# Altium schematic sheet CEM3340.SchDoc
size B; SheetNumber: 1; SheetTotal: 1
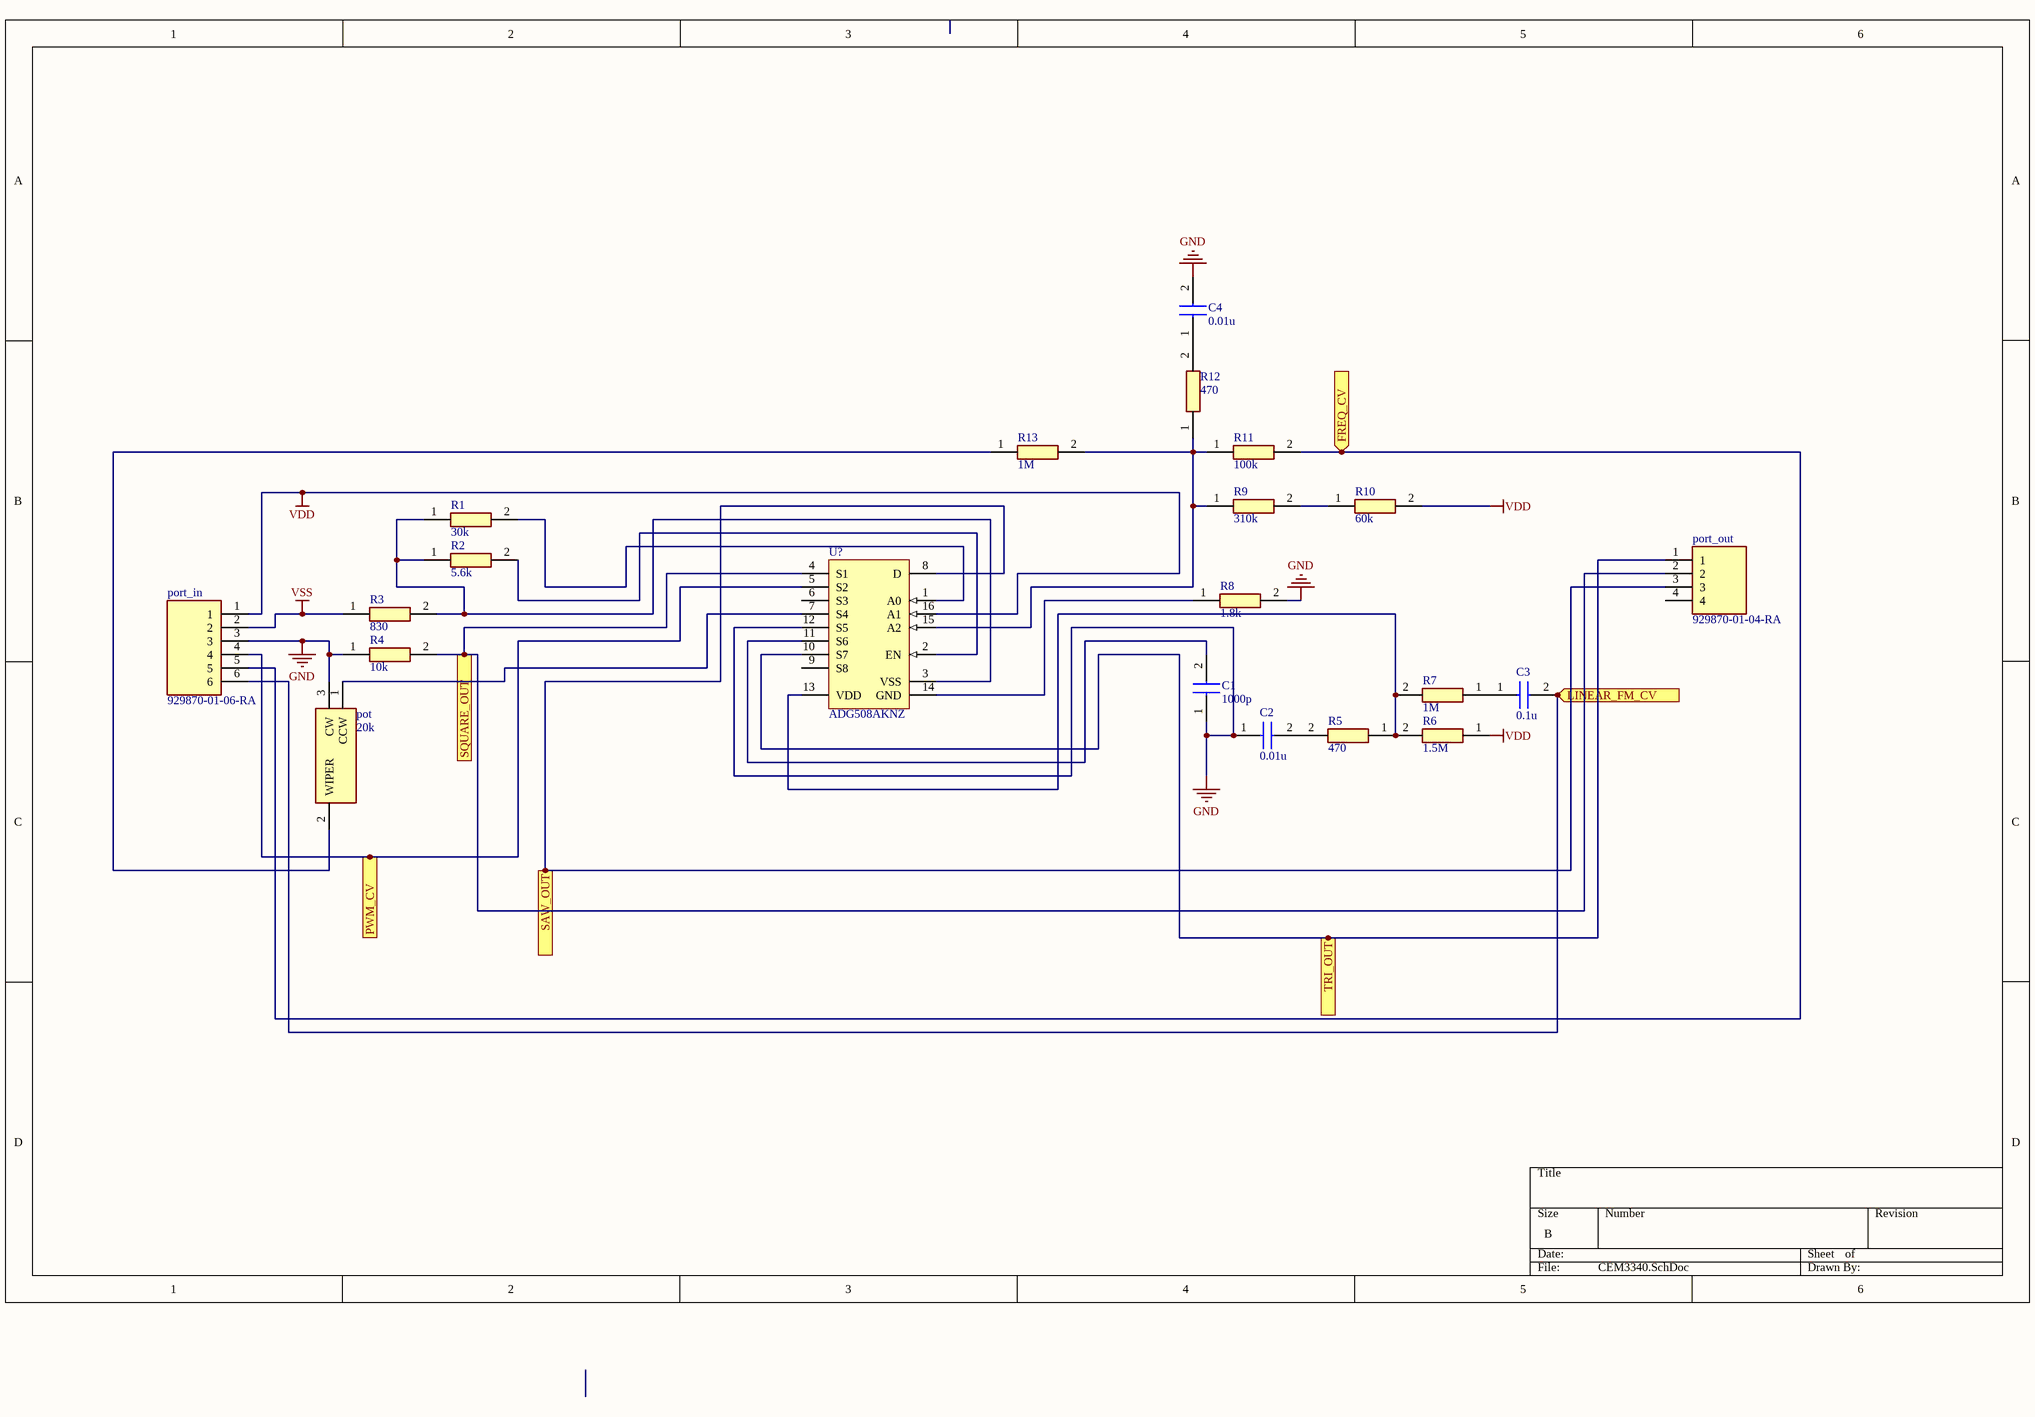
[diagram p0: CEM3340.SchDoc]

## Parts
C1  1000p  [CAPPA2400W30L800D400]
C2  0.01u  [CAPPA2400W30L800D400]
C3  0.1u  [CAPPA2400W30L800D400]
C4  0.01u  [CAPPA2400W30L800D400]
port_in  929870-01-06-RA  [RHDR6W64P0X254_1X6_1524X254X380P]
port_out  929870-01-04-RA  [RHDR4W76P0X254_1X4_1016X254X826P]
pot  20k  [3296P1502LF]
R1  30k  [RESAD1650W60L650D250]
R2  5.6k  [RESAD1650W60L650D250]
R3  830  [RESAD1650W60L650D250]
R4  10k  [RESAD1650W60L650D250]
R5  470  [RESAD1650W60L650D250]
R6  1.5M  [RESAD1650W60L650D250]
R7  1M  [RESAD1650W60L650D250]
R8  1.8k  [RESAD1650W60L650D250]
R9  310k  [RESAD1650W60L650D250]
R10  60k  [RESAD1650W60L650D250]
R11  100k  [RESAD1650W60L650D250]
R12  470  [RESAD1650W60L650D250]
R13  1M  [RESAD1650W60L650D250]
U?  ADG508AKNZ  [ADI-N-16]

## Ports
FREQ_CV (in), LINEAR_FM_CV (in), PWM_CV, SAW_OUT, SQUARE_OUT, TRI_OUT

## Nets
GND: C1.1(+) C2.1(+) C4.2(-) port_in.3 pot.3(CW) R4.1 R8.2 U?.12(S5)
VDD: port_in.1 R6.1 R10.2 U?.16(A1)
VSS: port_in.2 R3.1
FREQ_CV: port_in.5 R11.2 ; port FREQ_CV
LINEAR_FM_CV: C3.2(-) port_in.6 ; port LINEAR_FM_CV
PWM_CV: port_in.4 U?.5(S2) ; port PWM_CV
SAW_OUT: port_out.3 U?.8(D) ; port SAW_OUT
SQUARE_OUT: port_out.2 R4.2 U?.4(S1) ; port SQUARE_OUT
TRI_OUT: port_out.1 U?.10(S7) ; port TRI_OUT
NetC1_2: C1.2(-) U?.11(S6)
NetC2_2: C2.2(-) R5.2
NetC3_1: C3.1(+) R7.1
NetC4_1: C4.1(+) R12.2
Netpot_1: pot.1(CCW) U?.7(S4)
Netpot_2: pot.2(WIPER) R13.1
NetR1_1: R1.1 R2.1 R3.2 U?.3(VSS)
NetR1_2: R1.2 U?.1(A0)
NetR2_2: R2.2 U?.2(EN)
NetR5_1: R5.1 R6.2 R7.2 U?.13(VDD)
NetR8_1: R8.1 U?.14(GND)
NetR9_1: R9.1 R11.1 R12.1 R13.2 U?.15(A2)
NetR9_2: R9.2 R10.1

Not connected (* = marked no-connect by the designer): port_out 4; U? 6(S3) 9(S8)

## Library data of the parts
C1-C4 = 0113207: Capacitor; Manufacturer_Name: RS Pro; Datasheet Link: https://docs.rs-online.com/d68c/0900766b8157e121.pdf; Manufacturer_Part_Number: 0113207
port_in = 929870-01-06-RA: Connector; Manufacturer_Name: 3M; Datasheet Link: https://componentsearchengine.com/Datasheets/1/929870-01-06-RA.pdf; Height: 3.8mm; Manufacturer_Part_Number: 929870-01-06-RA; Mouser Part Number: 517-929870-01-06-RA; Mouser Price/Stock: https://www.mouser.co.uk/ProductDetail/3M-Electronic-Solutions-Division/929870-01-06-RA?qs=neFkstNq%252B6F6Q7pF8hOFFA%3D%3D; Arrow Part Number: 929870-01-06-RA; Arrow Price/Stock: https://www.arrow.com/en/products/929870-01-06-ra/3m?region=nac
port_out = 929870-01-04-RA: Connector; Manufacturer_Name: 3M; Datasheet Link: https://componentsearchengine.com/Datasheets/2/929870-01-04-RA.pdf; Height: 8.26mm; Manufacturer_Part_Number: 929870-01-04-RA; Mouser Part Number: 517-929870-01-04-RA; Mouser Price/Stock: https://www.mouser.co.uk/ProductDetail/3M-Electronic-Solutions-Division/929870-01-04-RA?qs=neFkstNq%252B6GPZEKactAgTg%3D%3D; Arrow Part Number: 929870-01-04-RA; Arrow Price/Stock: https://www.arrow.com/en/products/929870-01-04-ra/3m
pot = 3296P-1-203LF: Variable Resistor; Manufacturer_Name: Bourns; Datasheet Link: https://www.bourns.com/pdfs/3296.pdf; Height: 4.96mm; Manufacturer_Part_Number: 3296P-1-203LF; Mouser Part Number: 652-3296P-1-203LF; Mouser Price/Stock: https://www.mouser.co.uk/ProductDetail/Bourns/3296P-1-203LF?qs=2EY8XwU7iu%2FBEM7pUMj5aA%3D%3D; Arrow Part Number: 3296P-1-203LF; Arrow Price/Stock: https://www.arrow.com/en/products/3296p-1-203lf/bourns?region=nac
R1-R13 = MRS25000C1003FC100: Resistor; Manufacturer_Name: Vishay; Datasheet Link: http://www.vishay.com/docs/28724/mrs16m25.pdf; Manufacturer_Part_Number: MRS25000C1003FC100; Mouser Part Number: 594-MRS25000C1003FC1; Mouser Price/Stock: https://www.mouser.co.uk/ProductDetail/Vishay-BC-Components/MRS25000C1003FC100?qs=H30XFsNYD%2FHyk6mBpuomxg%3D%3D; Arrow Part Number: MRS25000C1003FC100; Arrow Price/Stock: https://www.arrow.com/en/products/mrs25000c1003fc100/vishay?region=nac
U? = CMP-0793-00029-1: CMOS 8-Channel Analog Multiplexer, 280 Ohm / 500 Ohm Ron, 16-pin DIP (N-16), Tube; Manufacturer: Analog Devices; t transition (s): 200n; Ron (ohms): 280; Max Analog Signal Range: Vss to Vdd; Packing: Tube; Code_JEDEC: MS-001; Mounting Technology: Through Hole; ComponentLink1Description: Manufacturer URL; ComponentLink2Description: Datasheet; ComponentLink3URL: http://www.analog.com/static/imported-files/packages/44768431550332N_16.pdf; PackageReference: N-16; ComponentLink1URL: http://www.analog.com/en/index.html; ComponentLink2URL: http://www.analog.com/static/imported-files/data_sheets/ADG508A_509A.pdf; DatasheetVersion: Rev. D; PackageVersion: 070706-A, 07/2006; ComponentLink3Description: Package Specification; PackageDescription: 16-Pin Plastic Dual In-Line Package, Row spacing 7.62 mm, Pitch 2.54 mm; PartNumber: ADG508AKNZ